# EasyEDA Pro project ProPrj_stmf4+esp32s3转接板_2025-01-29.epro, schematic Schematic1_1
Board Name: STM32F407; Create Date: 2024-12-29; Page Name: P1; Project Name: stmf4+esp32s3转接板; Schematic Name: Schematic1_1; Update Date: 2025-01-27; Company: 嘉立创EDA; Page Size: A4; Version: V1.0
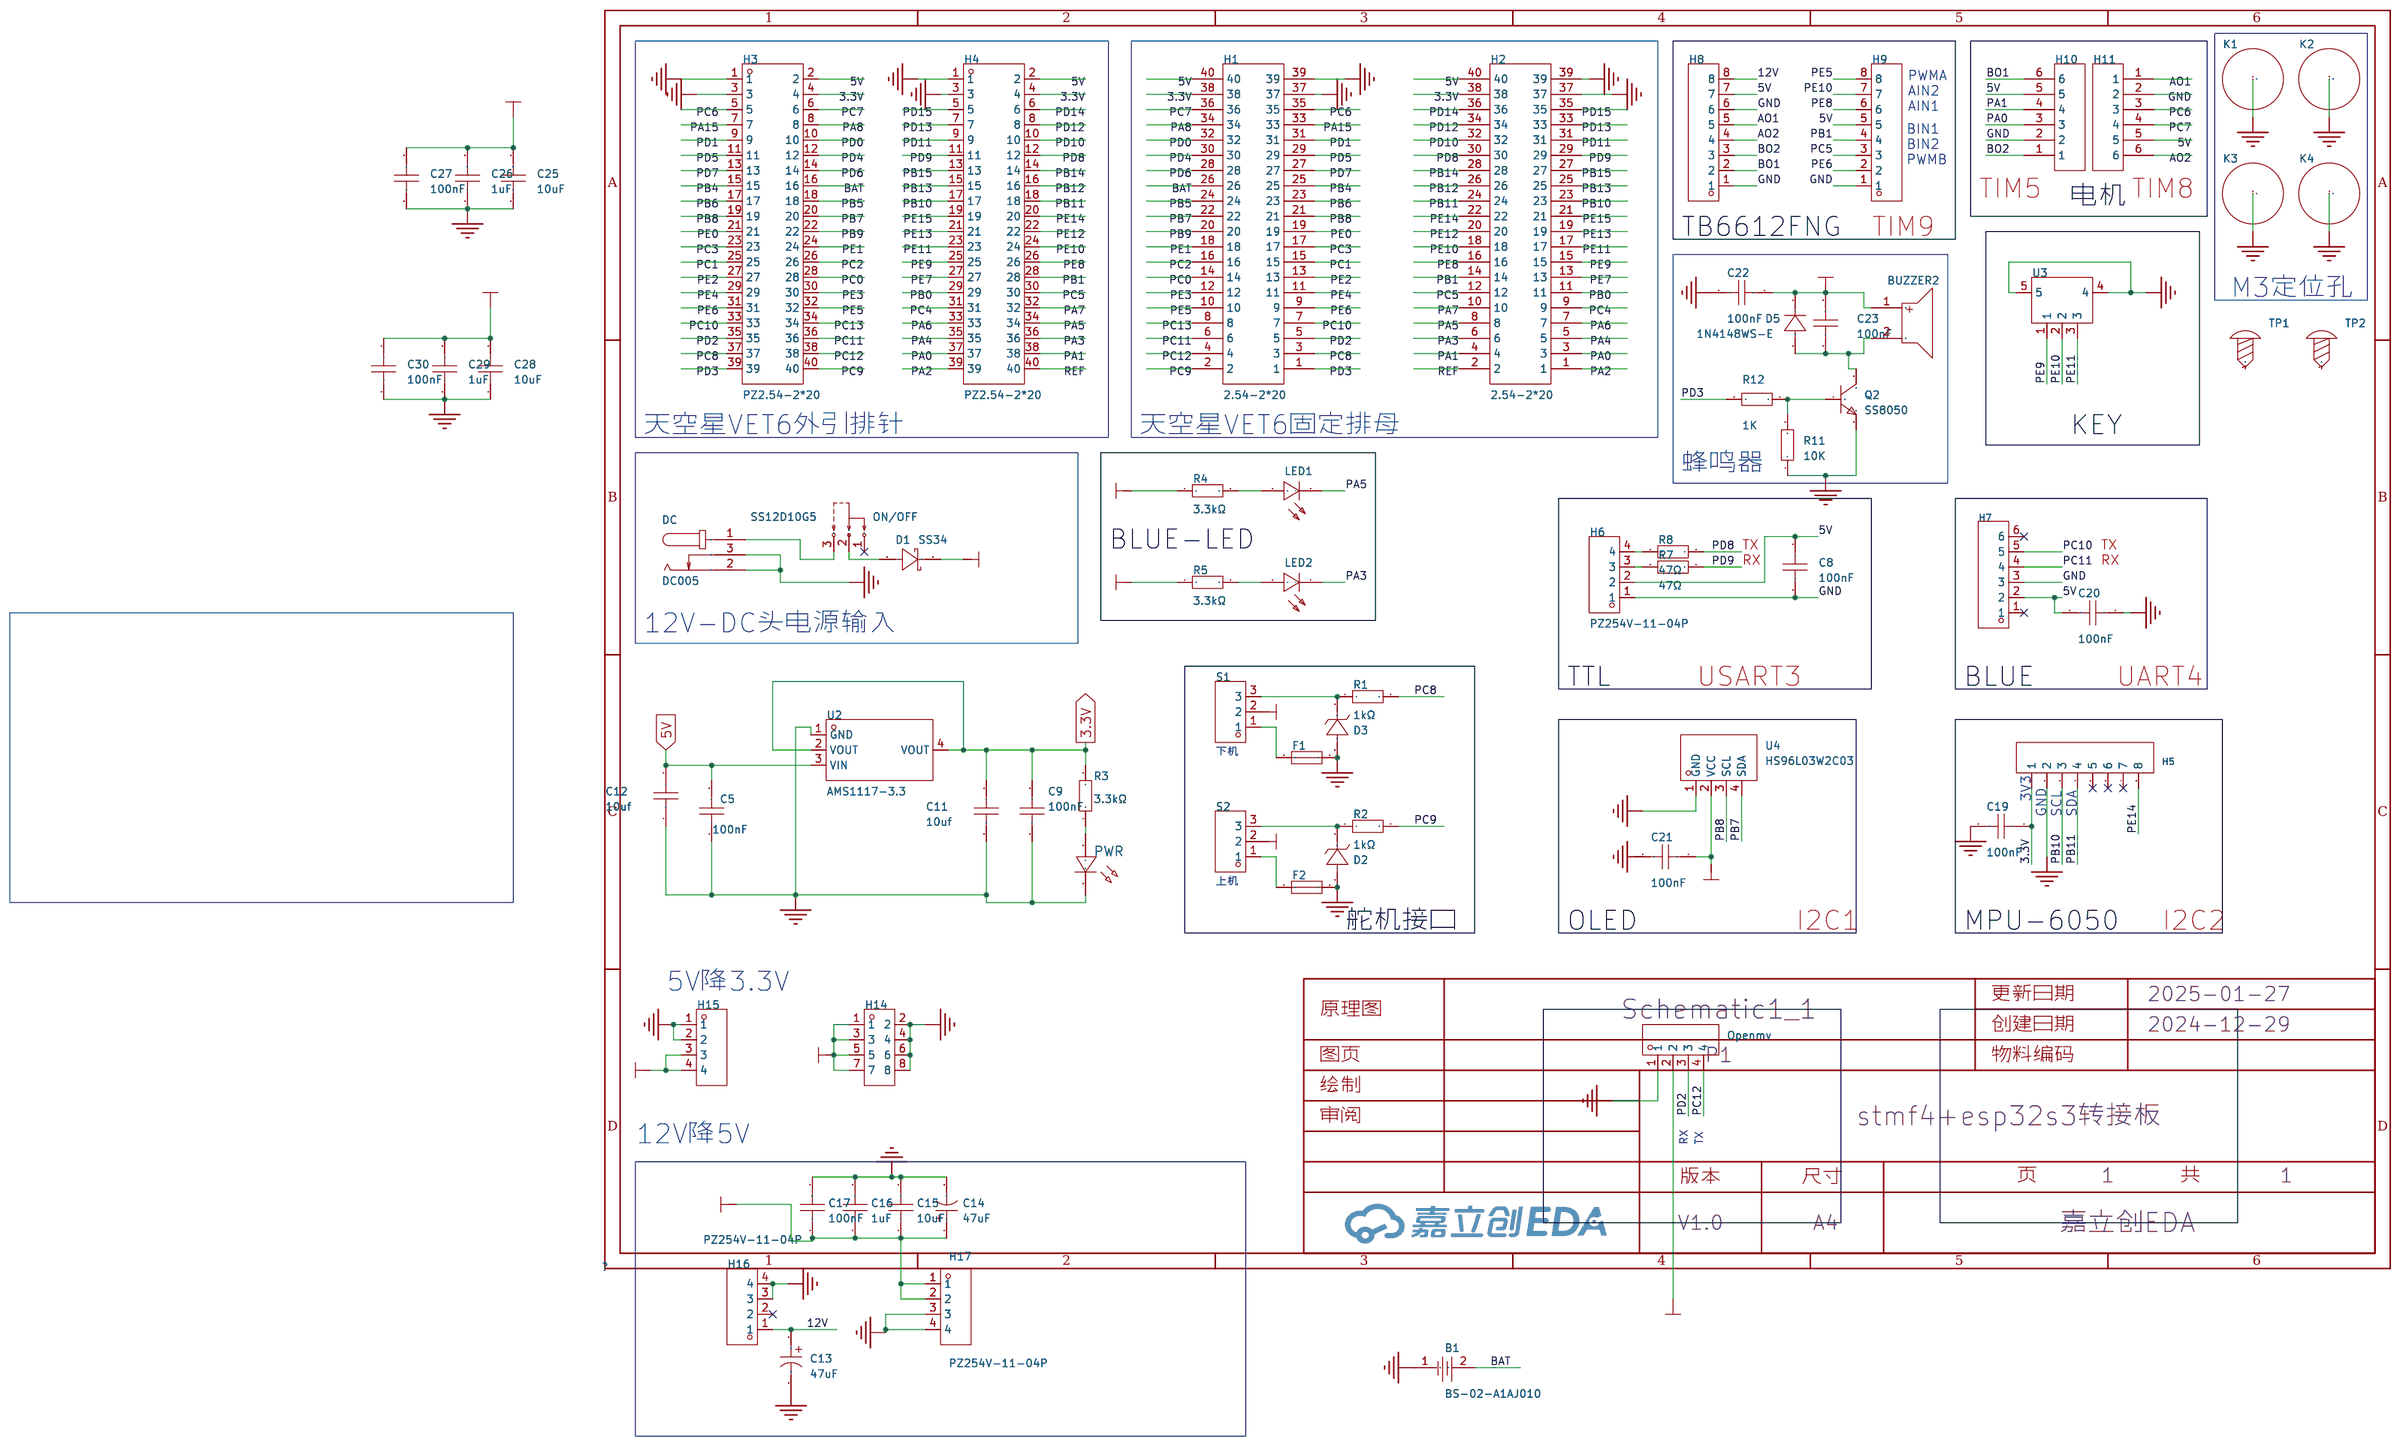
[diagram p1: schematic sheet]

## Parts
B1  BS-02-A1AJ010  [BAT-TH_BS-02-A1AJ010]
BUZZER2  2.7kHz  [BUZ-TH_BD9.0-P4.00-D0.6-FD]
C5  100nF  [C0603]
C8  100nF  [C0603]
C9  100nF  [C0805]
C11  10uf  [C0805]
C12  10uf  [C0805]
C13  47uF  [CAP-SMD_BD6.3-L6.6-W6.6-LS7.2-FD]
C14  47uF  [CAP-SMD_BD6.3-L6.6-W6.6-LS7.2-FD]
C15  10uF  [C0603]
C16  1uF  [C0603]
C17  100nF  [C0603]
C19  100nF  [C0603]
C20  100nF  [C0603]
C21  100nF  [C0603]
C22  100nF  [C0603]
C23  100nF  [C0603]
C25  10uF  [C0603]
C26  1uF  [C0603]
C27  100nF  [C0603]
C28  10uF  [C0603]
C29  1uF  [C0603]
C30  100nF  [C0603]
D1  SS34  [SMA_L4.3-W2.5-LS5.0-RD]
D2  ZMM3V3  [LL-34_L3.5-W1.5-RD]
D3  ZMM3V3  [LL-34_L3.5-W1.5-RD]
D5  1N4148WS-E  [SOD-323_L1.8-W1.3-LS2.5-RD]
DC  DC005  [DC-IN-TH_DC005]
F1  BSMD1812-200-30V  [F1812]
F2  BSMD1812-200-30V  [F1812]
H1  2.54-2*20  [HDR-TH_40P-P2.54-V-F-R2-C20-S2.54]
H2  2.54-2*20  [HDR-TH_40P-P2.54-V-F-R2-C20-S2.54]
H3  PZ2.54-2*20  [HDR-TH_40P-P2.54-V-M-R2-C20-S2.54]
H4  PZ2.54-2*20  [HDR-TH_40P-P2.54-V-M-R2-C20-S2.54]
H5  -  [HDR-TH_8P-P2.54-V-F-1]
H6  PZ254V-11-04P  [HDR-TH_4P-P2.54-V-M]
H7  -  [HDR-TH_6P-P2.54-V-F]
H8  PM254-1-08-Z-8.5  [HDR-TH_8P-P2.54-V-F]
H9  PM254-1-08-Z-8.5  [HDR-TH_8P-P2.54-V-F]
H10  B6B-XH-A(LF)(SN)  [CONN-TH_6P-P2.50_B6B-XH-A-LF-SN]
H11  B6B-XH-A(LF)(SN)  [CONN-TH_6P-P2.50_B6B-XH-A-LF-SN]
H14  PZ254V-12-8P  [HDR-TH_8P-P2.54-V-M-R2-C4-S2.54]
H15  PZ254V-11-04P  [HDR-TH_4P-P2.54-V-M]
H16  PZ254V-11-04P  [HDR-TH_4P-P2.54-V-M]
H17  PZ254V-11-04P  [HDR-TH_4P-P2.54-V-M]
K1  -  [125 X 300]
K2  -  [125 X 300]
K3  -  [125 X 300]
K4  -  [125 X 300]
LED1  NCD0603B1  [LED0603-RD]
LED2  NCD0603B1  [LED0603-RD]
ON/OFF  SS12D10G5  [SW-TH_SHOU-HAN_SS12D10G4]
Openmv  PM254-1-04-Z-8.5  [HDR-TH_4P-P2.54-V-F]
PWR  -  [LED_0603]
Q2  SS8050  [SOT-23-3_L2.9-W1.3-P1.90-LS2.4-BR]
R1  1kΩ  [R0805]
R2  1kΩ  [R0805]
R3  3.3kΩ  [R0603]
R4  3.3kΩ  [R0603]
R5  3.3kΩ  [R0603]
R7  47Ω  [R0603]
R8  47Ω  [R0603]
R11  10K  [R0603]
R12  1K  [R0603]
S1  PZ254R-11-03P  [HDR-TH_3P-P2.54-H-M-W10.4]
S2  PZ254R-11-03P  [HDR-TH_3P-P2.54-H-M-W10.4]
TP1  -  [M2螺丝]
TP2  -  [M2螺丝]
U2  AMS1117-3.3  [SOT-223-3_L6.5-W3.4-P2.30-LS7.0-BR]
U3  QS-301-AGS5P  [SW-SMD_QS-301-AGS5P]
U4  HS96L03W2C03  [OLED-TH_L27.8-W27.2-P2.54_C9900033791]

## Library data of the parts
B1 = BS-02-A1AJ010: 连接器类型:电池底座;适用电池规格:CR2032;触头材质:磷青铜;触点电镀:镍;工作温度范围:-25℃~+85℃;; LCSC Part Name: 电池底座 适用电池:CR2032; Supplier Part: C5239862; Manufacturer: MYOUNG(美阳); Supplier Footprint: 插件; JLCPCB Part Class: 扩展库; Datasheet: https://atta.szlcsc.com/upload/public/pdf/source/20221102/8F00F2B23A2A3C447A59C327BBA6C743.pdf; Supplier: LCSC; Connector Type: 电池底座; Battery Type: CR2032; Contact Material: 磷青铜; Contact Plating: 镍; Operating Temperature Range: -25℃~+85℃
BUZZER2 = QMB-09B-03: 驱动方式:无源(外部驱动);构造类型:电磁式;频率:2.7kHz;声压(SPL):85dB@3V,10cm;; LCSC Part Name: 无源蜂鸣器QMB-09B-03; Supplier Part: C96256; Manufacturer: 华能; Supplier Footprint: 插件,D=9mm; JLCPCB Part Class: 扩展库; Datasheet: https://atta.szlcsc.com/upload/public/pdf/source/20210401/C96256_958B17753B5AD7CBFBCFFC7C095B4484.pdf; Supplier: LCSC; Oscillator Circuit: 无源(外部驱动); Technology Type: 电磁式; Operating Voltage: 2V~5V; Sound Pressure Level (SPL): 85dB@3V,10cm; Diameter (φD): 9mm; Height: 5.7mm
C5 C8 = CL10B104KB8NNNC: 容值:100nF;精度:±10%;额定电压:50V;材质(温度系数):X7R;; LCSC Part Name: 100nF ±10% 50V; Supplier Part: C1591; Manufacturer: SAMSUNG(三星); Supplier Footprint: 0603; JLCPCB Part Class: 扩展库; Datasheet: https://atta.szlcsc.com/upload/public/pdf/source/20160218/1457707763339.pdf; Supplier: LCSC; Tolerance: ±10%; Voltage Rated: 50V; Temperature Coefficient: X7R
C9 C11 C12 = CAP_0805: Supplier Footprint: 0805
C13 C14 = RVT47UF35V67RV0039: 容值:47uF;精度:±20%;额定电压:35V;纹波电流:16.4mA@120Hz;等效串联电阻:-;; LCSC Part Name: 47uF ±20% 35V; Supplier Part: C2836440; Manufacturer: KNSCHA(科尼盛); Supplier Footprint: SMD,D6.3xL5.4mm; JLCPCB Part Class: 扩展库; Datasheet: https://atta.szlcsc.com/upload/public/pdf/source/20210528/C2836440_FB61BB3A7A46B9CC2A608A35871DBF0C.pdf; Supplier: LCSC; Tolerance: ±20%; Rated Voltage: 35V; Ripple Current: 16.4mA@120Hz; φD: 6.3mm; L: 5.4mm; Lifetime @ Temp: 2000hrs@105℃; Operating Temperature: -55℃~+105℃
C15 C25 C28 = CGA0603X5R106K100JT: 容值:10uF;精度:±10%;额定电压:10V;材质(温度系数):X5R;; LCSC Part Name: 10uF ±10% 10V; Supplier Part: C6119842; Manufacturer: HRE(芯声); Supplier Footprint: 0603; JLCPCB Part Class: 扩展库; Supplier: LCSC; Tolerance: ±10%; Voltage Rated: 10V; Temperature Coefficient: X5R
C16 C26 C29 = CGA0603X5R105K160JT: 容值:1uF;精度:±10%;额定电压:16V;材质(温度系数):X5R;; LCSC Part Name: 1uF ±10% 16V; Supplier Part: C6119849; Manufacturer: HRE(芯声); Supplier Footprint: 0603; JLCPCB Part Class: 扩展库; Supplier: LCSC; Tolerance: ±10%; Voltage Rated: 16V; Temperature Coefficient: X5R
C17 = CGA0603X7R104K500JT: 容值:100nF;精度:±10%;额定电压:50V;材质(温度系数):X7R;; LCSC Part Name: 100nF ±10% 50V; Supplier Part: C6119867; Manufacturer: HRE(芯声); Supplier Footprint: 0603; JLCPCB Part Class: 扩展库; Supplier: LCSC; Tolerance: ±10%; Voltage Rated: 50V; Temperature Coefficient: X7R
C19-C23 C27 C30 = CAP_0603: Supplier Footprint: 0603
D1 = SS34_C727060: 二极管配置:独立式;正向压降(Vf):550mV@3A;直流反向耐压(Vr):40V;平均整流电流(Io):3A;; LCSC Part Name: 电压:40V 电流:3A; Supplier Part: C727060; Manufacturer: TWGMC(台湾迪嘉); Supplier Footprint: SMA(DO-214AC); JLCPCB Part Class: 扩展库; Datasheet: https://atta.szlcsc.com/upload/public/pdf/source/20200828/C727059_6599B6CAC5F3238B9C33E46794659DBE.pdf; Supplier: LCSC; Diode Configuration: 独立式; Forward Voltage (Vf@If): 550mV@3A; Reverse Voltage (Vr): 40V; Average Rectified Current (Io): 3A; Reverse Leakage Current (Ir): 500uA@40V
D2 D3 = ZMM3V3_C707189: 稳压值(标称值):-;功率:500mW;精度:-;; Supplier Part: C707189; Manufacturer: Slkor(萨科微); Supplier Footprint: LL-34; JLCPCB Part Class: 扩展库; Datasheet: https://atta.szlcsc.com/upload/public/pdf/source/20200721/C707184_776B95022AAA01ECB528B9CFDAFDB27C.pdf; Supplier: LCSC; Reverse Leakage Current (Ir): 2uA@1V; Power Dissipation: 500mW
D5 = 1N4148WS-E: 二极管配置:-;正向压降(Vf):-;直流反向耐压(Vr):-;; LCSC Part Name: 开关二极管; Supplier Part: C41371421; Manufacturer: MDD(辰达半导体); Supplier Footprint: SOD-323; Datasheet: https://atta.szlcsc.com/upload/public/pdf/source/20240830/BA1E56105C5798AA4D5522D8577BF8A0.pdf; Supplier: LCSC
DC = DC005: 连接器类型:DC电源插座;安装方式:弯插;触点内径:2mm;触点外径:6.3mm;额定电流:500mA;额定电压:30V;工作温度范围:-40℃~+55℃;; LCSC Part Name: DC电源插座 内径:2mm 外径:6.3mm; Supplier Part: C431533; Manufacturer: SHOU HAN(首韩); Supplier Footprint: 插件; Datasheet: https://atta.szlcsc.com/upload/public/pdf/source/20190925/C431533_4751811035784AC1D38EBC85F7905E99.pdf; Supplier: LCSC; Connector Type: DC电源插座; Mounting Style: 弯插; Inside Contact Diameter: 2mm; Outside Contact Diameter: 6.3mm; Current Rating (Max): 500mA; Voltage Rating (Max): 30V; Operating Temperature Range: -40℃~+55℃
F1 F2 = BSMD1812-200-30V: 最大电压:30V;最大电流:40A;保持电流:2A;跳闸电流:4A;; LCSC Part Name: 30V 2A 1812自恢复; Supplier Part: C960026; Manufacturer: BHFUSE(佰宏); Supplier Footprint: 1812; JLCPCB Part Class: 扩展库; Datasheet: https://atta.szlcsc.com/upload/public/pdf/source/20230512/6ED7FF50F668B3AF958C55F12246A840.pdf; Supplier: LCSC; Operating Voltage (Max): 30V; Current Rating (Max): 40A; Hold Current: 2A; Trip Current: 4A; Power Dissipation: 1W; Resistance - Initial (Ri) (Min): 20mΩ; Resistance - Post Trip (R1) (Max): 100mΩ; Maximum Time to Trip: 2s; Operating Temperature: -40℃~+85℃
H1 H2 = 2.54-2*20: 插孔结构:2x20P;间距:2.54mm;行距:2.54mm;圆孔/方孔:方孔;安装类型:直插;排数:双排;总孔位数:40P;额定电流:2.5A;额定电压:-;插孔方向:顶部;塑高:8.5mm;工作温度范围:-40℃~+105℃;; LCSC Part Name: 间距:2.54mm 2x20P 直插; Supplier Part: C2977589; Manufacturer: ZHOURI(洲日); Supplier Footprint: 插件,P=2.54mm; JLCPCB Part Class: 扩展库; Datasheet: https://atta.szlcsc.com/upload/public/pdf/source/20220328/834E302BE3C038BBC5C70F5E02589B1E.pdf; Supplier: LCSC; Holes Structure: 2x20P; Pitch: 2.54mm; Row Spacing: 2.54mm; Circular Hole / Square Hole: 方孔; Mounting Type: 直插; Number of Rows: 双排; Number of Holes: 40P; Current Rating (Max): 2.5A; Holes Direction: 顶部; Insulation Height: 8.5mm; Operating Temperature Range: -40℃~+105℃
H3 H4 = PZ2.54-2*20: 插针结构:2x20P;间距:2.54mm;安装类型:直插;排数:双排;总PIN位数:40P;触头镀层:金;; Supplier Part: C5224014; Manufacturer: ZHOURI(洲日); Supplier Footprint: 插件,P=2.54mm; JLCPCB Part Class: 扩展库; Datasheet: https://atta.szlcsc.com/upload/public/pdf/source/20221102/7E8316C38DB6D81BB18273F4CFF8B2F6.pdf; Supplier: LCSC; Pin Structure: 2x20P; Pitch: 2.54mm; Mounting Type: 直插; Number of Rows: 双排; Number of Pins: 40P; Contact Plating: 金
H5 = HDR-F_2.54_1x8P: Supplier Part: C27438; Supplier Footprint: 插件
H6 H15-H17 = PZ254V-11-04P: 插针结构:1x4P;间距:2.54mm;行距:-;圆针/方针:方针;安装类型:直插;排数:单排;总PIN位数:4P;额定电流:3A;额定电压:250V;配合针长度:6mm;塑高:2.5mm;端接针长度:3mm;触头材质:-;工作温度范围:-40℃~+105℃;颜色:黑色;; LCSC Part Name: 间距:2.54mm 1x4P 直插 方针; Supplier Part: C2691448; Manufacturer: XFCN(兴飞); Supplier Footprint: 插件,P=2.54mm; JLCPCB Part Class: 扩展库; Datasheet: https://atta.szlcsc.com/upload/public/pdf/source/20200309/C492403_F9F19131791D08044AD4F84F8E751A34.pdf; Supplier: LCSC; Pin Structure: 1x4P; Pitch: 2.54mm; Circluar Pins/Square Pins: 方针; Mounting Type: 直插; Number of Rows: 单排; Number of Pins: 4P; Current Rating (Max): 3A; Voltage Rating (Max): 250V; Length of Mating Pin: 6mm; Insulation Height: 2.5mm; Length of End Connection Pin: 3mm; Operating Temperature Range: -40℃~+105℃; Color: 黑色
H7 = HDR-F_2.54_1x6P: Supplier Part: C40877; Supplier Footprint: 插件
H8 H9 = PM254-1-08-Z-8.5: 排数:单排;总孔位数:8P;间距:2.54mm;插孔结构:1x8P;行距:-;安装类型:直插;圆孔/方孔:方孔;额定电流:3A;额定电压:-;插孔方向:顶部;塑高:8.5mm;工作温度范围:-40℃~+105℃;; LCSC Part Name: 间距:2.54mm 1x8P 直插; Supplier Part: C2897371; Manufacturer: HCTL(华灿天禄); Supplier Footprint: 插件,P=2.54mm; JLCPCB Part Class: Extended Part; Datasheet: https://atta.szlcsc.com/upload/public/pdf/source/20230609/534BE42964C679BDE98E061007C4ABD6.pdf; Supplier: LCSC; Number of Rows: 单排; Number of Holes: 8P; Pitch: 2.54mm; Holes Structure: 1x8P; Mounting Type: 直插; Circular Hole / Square Hole: 方孔; Current Rating (Max): 3A; Holes Direction: 顶部; Insulation Height: 8.5mm; Operating Temperature Range: -40℃~+105℃
H10 H11 = B6B-XH-A(LF)(SN): 参考系列:XH;间距:2.5mm;插针结构:1x6P;排数:1;每排PIN数:6;行距:-;安装方式:-;触头材质:黄铜;; LCSC Part Name: 系列:XH 间距:2.5mm 1x6P; Supplier Part: C144397; Manufacturer: JST; Supplier Footprint: 插件,P=2.5mm; JLCPCB Part Class: Extended Part; Datasheet: https://atta.szlcsc.com/upload/public/pdf/source/20180928/C265283_F9DFEEBDB2CF642B6BDFAB4B77BD2680.pdf; Supplier: LCSC; Reference Series: XH; Pitch: 2.5mm; Pins Structure: 1x6P; Number of Rows: 1; Number of PINs Per Row: 6; Contact Material: 黄铜
H14 = PZ254V-12-8P: 插针结构:2x4P;间距:2.54mm;行距:2.54mm;圆针/方针:方针;安装类型:直插;排数:双排;总PIN位数:8P;额定电流:-;额定电压:-;配合针长度:6mm;塑高:2.5mm;端接针长度:3mm;触头材质:黄铜;触头镀层:-;工作温度范围:-40℃~+105℃;颜色:黑色;; LCSC Part Name: 间距:2.54mm 2x4P 直插 方针; Supplier Part: C492421; Manufacturer: XFCN(兴飞); Supplier Footprint: 插件,P=2.54mm; JLCPCB Part Class: 扩展库; Datasheet: https://atta.szlcsc.com/upload/public/pdf/source/20200309/C492421_DC8A206AF99CD7755BD4A5B0BC48200B.pdf; Supplier: LCSC; Pin Structure: 2x4P; Pitch: 2.54mm; Row Spacing: 2.54mm; Circluar Pins/Square Pins: 方针; Mounting Type: 直插; Number of Rows: 双排; Number of Pins: 8P; Length of Mating Pin: 6mm; Insulation Height: 2.5mm; Length of End Connection Pin: 3mm; Contact Material: 黄铜; Operating Temperature Range: -40℃~+105℃; Color: 黑色
K1-K4 = 125 X 300
LED1 LED2 = NCD0603B1: 发光颜色:蓝色;正向电压(VF):2.6V~3.6V;功率:72mW;正向电流:10mA;主波长:463nm~475nm;透镜颜色:无色透明透镜;发光强度:80mcd~220mcd;发光角度:130°;工作温度:-30℃~+85℃;; Supplier Part: C84266; Manufacturer: 国星光电; Supplier Footprint: 0603; Datasheet: https://atta.szlcsc.com/upload/public/pdf/source/20200820/C84266_6A3CDBEFA72C6CAD68EDA53474ADAE6C.pdf; Supplier: LCSC; Emitted Color: 蓝色; Forward Voltage (VF): 2.6V~3.6V; Power Dissipation: 72mW; Forward Current: 10mA; Dominant Wavelength: 463nm~475nm; Lens Color: 无色透明透镜; Luminous Intensity: 80mcd~220mcd; Viewing Angle: 130°; Operating Temperature: -30℃~+85℃
ON/OFF = SS12D10G5: 电路结构:单刀双掷;安装方式:直插;额定电流(DC):2A;额定电压(DC):125V;机械寿命:3千次;; LCSC Part Name: 两档立式插件 3脚拨动开关 柄长5.0mm; Supplier Part: C7431054; Manufacturer: SHOU HAN(首韩); Supplier Footprint: 插件; JLCPCB Part Class: 扩展库; Datasheet: https://atta.szlcsc.com/upload/public/pdf/source/20231130/7A3DB6A149BF0A1DCFFE64FFC07FE434.pdf; Supplier: LCSC; Circuit: 单刀双掷; Switch Length: 12.7mm; Switch Width: 6.7mm; Mounting Style: 直插; Current Rating (DC): 2A; Voltage Rating (DC): 125V; Mechanical Life: 3千次; Operating Temperature: -25℃~+70℃
Openmv = PM254-1-04-Z-8.5_C2897367: 插孔结构:1x4P;间距:2.54mm;行距:-;圆孔/方孔:方孔;安装类型:直插;排数:单排;总孔位数:4P;额定电流:3A;额定电压:-;插孔方向:顶部;塑高:8.5mm;触头材质:铜合金;工作温度范围:-40℃~+105℃;焊接温度(最大值):260℃@5S;; LCSC Part Name: 1x4P 间距:2.54mm 直插; Supplier Part: C2897367; Manufacturer: HCTL(华灿天禄); Supplier Footprint: 插件,P=2.54mm; JLCPCB Part Class: 扩展库; Datasheet: https://atta.szlcsc.com/upload/public/pdf/source/20230609/534BE42964C679BDE98E061007C4ABD6.pdf; Supplier: LCSC; Holes Structure: 1x4P; Pitch: 2.54mm; Circular Hole / Square Hole: 方孔; Mounting Type: 直插; Number of Rows: 单排; Number of Holes: 4P; Current Rating (Max): 3A; Holes Direction: 顶部; Insulation Height: 8.5mm; Contact Material: 铜合金; Operating Temperature Range: -40℃~+105℃; Soldering Temperature(Max): 260℃@5S
PWR = LED_0603-R: Supplier Footprint: 0603
Q2 = SS8050_C2150: 晶体管类型:NPN;集电极电流(Ic):1.5A;集射极击穿电压(Vceo):25V;功率(Pd):300mW;直流电流增益(hFE@Ic,Vce):200@100mA,1V;; LCSC Part Name: SS8050(RANGE:200-350) hfe=200~350; Supplier Part: C2150; Manufacturer: CJ(江苏长电/长晶); Supplier Footprint: SOT-23; JLCPCB Part Class: 基础库; Datasheet: https://atta.szlcsc.com/upload/public/pdf/source/20230322/AEE86F4B043774EFF80CAEA14A37D9E9.pdf; Supplier: LCSC; Transistor Type: NPN; Collector Current (Ic): 1.5A; Collector-Emitter Breakdown Voltage (Vceo): 25V; Power Dissipation (Pd): 300mW; DC Current Gain (hFE@Ic,Vce): 200@100mA,1V; Transition Frequency (fT): 100MHz; Collector Cut-Off Current (Icbo): 100nA; Collector-Emitter Saturation Voltage (VCE(sat)@Ic,Ib): 500mV@800mA,80mA
R1 R2 = 0805W8F1001T5E: 电阻类型:厚膜电阻;阻值:1kΩ;精度:±1%;功率:125mW;最大工作电压:150V;温度系数:±100ppm/℃;; LCSC Part Name: 1kΩ ±1% 125mW 厚膜电阻; Supplier Part: C17513; Manufacturer: UNI-ROYAL(厚声); Supplier Footprint: 0805; JLCPCB Part Class: 基础库; Datasheet: https://atta.szlcsc.com/upload/public/pdf/source/20200306/C422600_1E6D84923E4A46A82E41ADD87F860B5C.pdf; Supplier: LCSC; Type: 厚膜电阻; Tolerance: ±1%; Power(Watts): 125mW; Overload Voltage (Max): 150V; Temperature Coefficient: ±100ppm/℃; Operating Temperature Range: -55℃~+155℃
R3-R5 = 0603WAF3301T5E: 电阻类型:厚膜电阻;阻值:3.3kΩ;精度:±1%;功率:100mW;最大工作电压:75V;温度系数:±100ppm/℃;; LCSC Part Name: 3.3kΩ ±1% 100mW 厚膜电阻; Supplier Part: C22978; Manufacturer: UNI-ROYAL(厚声); Supplier Footprint: 0603; JLCPCB Part Class: 基础库; Datasheet: https://atta.szlcsc.com/upload/public/pdf/source/20200306/C422600_1E6D84923E4A46A82E41ADD87F860B5C.pdf; Supplier: LCSC; Type: 厚膜电阻; Tolerance: ±1%; Power(Watts): 100mW; Overload Voltage (Max): 75V; Temperature Coefficient: ±100ppm/℃; Operating Temperature Range: -55℃~+155℃
R7 R8 = 0603WAF470JT5E: 电阻类型:厚膜电阻;阻值:47Ω;精度:±1%;功率:100mW;最大工作电压:75V;温度系数:±100ppm/℃;; LCSC Part Name: 47Ω ±1% 100mW 厚膜电阻; Supplier Part: C23182; Manufacturer: UNI-ROYAL(厚声); Supplier Footprint: 0603; JLCPCB Part Class: 基础库; Datasheet: https://atta.szlcsc.com/upload/public/pdf/source/20200306/C422600_1E6D84923E4A46A82E41ADD87F860B5C.pdf; Supplier: LCSC; Type: 厚膜电阻; Tolerance: ±1%; Power(Watts): 100mW; Overload Voltage (Max): 75V; Temperature Coefficient: ±100ppm/℃; Operating Temperature Range: -55℃~+155℃
R11 R12 = Res_0603: Supplier Footprint: 0603
S1 S2 = PZ254R-11-03P: 插针结构:1x3P;间距:2.54mm;行距:-;圆针/方针:方针;安装类型:弯插;排数:单排;总PIN位数:3P;额定电流:-;额定电压:-;配合针长度:6mm;塑高:2.5mm;触头材质:黄铜;触头镀层:-;工作温度范围:-40℃~+105℃;颜色:黑色;; LCSC Part Name: 间距:2.54mm 1x3P 弯插 方针; Supplier Part: C492411; Manufacturer: XFCN(兴飞); Supplier Footprint: 弯插,P=2.54mm; JLCPCB Part Class: 扩展库; Datasheet: https://atta.szlcsc.com/upload/public/pdf/source/20200309/C492411_5256E8AAA7569F6D33B6ADBFAE4F2888.pdf; Supplier: LCSC; Pin Structure: 1x3P; Pitch: 2.54mm; Circluar Pins/Square Pins: 方针; Mounting Type: 弯插; Number of Rows: 单排; Number of Pins: 3P; Length of Mating Pin: 6mm; Insulation Height: 2.5mm; Contact Material: 黄铜; Operating Temperature Range: -40℃~+105℃; Color: 黑色
TP1 TP2 = M2螺丝: Supplier Footprint: 插件
U2 = AMS1117-3.3_C6186: 输出类型:固定;最大输入电压:-;输出电压:3.3V;最大输出电流:1A;电源纹波抑制比(PSRR):72dB@(120Hz);输出极性:正极;; LCSC Part Name: 输出3.3V 1A; Supplier Part: C6186; Manufacturer: AMS; Supplier Footprint: SOT-223; JLCPCB Part Class: 基础库; Datasheet: https://atta.szlcsc.com/upload/public/pdf/source/20180727/C6186_7A095716F0823C02F1997A905E26C086.pdf; Supplier: LCSC; Output Type: 固定; Output Voltage: 3.3V; MAX Output Current: 1A; Power Supply Rejection Ratio (PSRR): 72dB@(120Hz); Dropout Voltage: 1.3V@(800mA); Output Polarity: 正极; Number of Outputs: 1
U3 = QS-301-AGS5P: 三脚 大头拨轮多功能开关 MP3/MP4换曲按键; LCSC Part Name: 三脚 大头拨轮多功能开关 MP3/MP4换曲按键; Supplier Part: C42377853; Manufacturer: XUNPU(讯普); Supplier Footprint: SMD; Datasheet: https://atta.szlcsc.com/upload/public/pdf/source/20241106/28956C8F7821B982CBB1BD5B1BCE3D5A.pdf; Supplier: LCSC
U4 = HS96L03W2C03: 主控芯片:SSD1315;接口类型:I2C;尺寸(inch):0.96;像素分辨率:128x64;; LCSC Part Name: 0.96寸OLED显示屏窄白光IIC; Supplier Part: C5248080; Manufacturer: HS(汉昇); JLCPCB Part Class: 扩展库; Datasheet: https://atta.szlcsc.com/upload/public/pdf/source/20230627/763D01F79A90007632F098068C7C8AD9.pdf; Supplier: LCSC; Main Control Chip: SSD1315; Interface Type: I2C; Size: 0.96; Pixel Resolution: 128x64; Operating Temperature: -40℃~+70℃

## Nets
3.3V: C9.2 C11.2 C19.1 C21.1 H1.38 H2.38 H3.4 H4.4 H5.1 R3.2 R4.1 R5.1 U2.2(VOUT) U2.4(VOUT) U4.2(VCC)
5V: BUZZER2.1 C5.2 C8.1 C12.2 C14.1 C15.1 C16.1 C17.1 C20.1 C22.2 C23.2 C25.2 C26.2 C27.1 C28.2 C29.2 C30.1 D5.1(K) H1.40 H2.40 H3.2 H4.2 H6.2 H7.2 H8.7 H9.5 H10.5 H11.5 H14.1 H14.3 H14.5 H14.7 H17.1 H17.2 Openmv.2 S1.2 S2.2 U2.3(VIN)
12V: C13.1 D1.1(C) H8.8 H15.3 H15.4 H16.1
GND: B1.1 C5.1 C8.2 C9.1 C11.1 C12.1 C13.2 C14.2 C15.2 C16.2 C17.2 C19.2 C20.2 C21.2 C22.1 C25.1 C26.1 C27.2 C28.1 C29.1 C30.2 D2.2(A) D3.2(A) DC.2 DC.3 F1.2 F2.2 H1.37 H1.39 H2.37 H2.39 H3.1 H3.3 H4.1 H4.3 H5.2 H6.1 H7.3 H8.1 H8.6 H9.1 H10.2 H11.2 H14.2 H14.4 H14.6 H14.8 H15.1 H15.2 H16.3 H16.4 H17.3 H17.4 K1.1 K2.1 K3.1 K4.1 Openmv.1 PWR.1(C) Q2.2(E) R11.1 U2.1(GND) U3.4 U3.5 U4.1(GND)
AO1: H8.5 H11.1
AO2: H8.4 H11.6
BAT: B1.2 H1.26 H3.16
BO1: H8.2 H10.6
BO2: H8.3 H10.1
PA0: H2.3 H4.37 H10.3
PA1: H2.4 H4.38 H10.4
PA2: H2.1 H4.39
PA3: H2.6 H4.36 LED2.1(-)
PA4: H2.5 H4.35
PA5: H2.8 H4.34 LED1.1(-)
PA6: H2.7 H4.33
PA7: H2.10 H4.32
PA8: H1.34 H3.8
PA15: H1.33 H3.7
PB0: H2.11 H4.29
PB1: H2.14 H4.28 H9.4
PB4: H1.25 H3.15
PB5: H1.24 H3.18
PB6: H1.23 H3.17
PB7: H1.22 H3.20 U4.4(SDA)
PB8: H1.21 H3.19 U4.3(SCL)
PB9: H1.20 H3.22
PB10: H2.23 H4.17 H5.3
PB11: H2.24 H4.18 H5.4
PB12: H2.26 H4.16
PB13: H2.25 H4.15
PB14: H2.28 H4.14
PB15: H2.27 H4.13
PC0: H1.14 H3.28
PC1: H1.15 H3.25
PC2: H1.16 H3.26
PC3: H1.17 H3.23
PC4: H2.9 H4.31
PC5: H2.12 H4.30 H9.3
PC6: H1.35 H3.5 H11.3
PC7: H1.36 H3.6 H11.4
PC8: H1.3 H3.37 R1.2
PC9: H1.2 H3.40 R2.2
PC10: H1.7 H3.33 H7.5
PC11: H1.6 H3.36 H7.4
PC12: H1.4 H3.38 Openmv.4
PC13: H1.8 H3.34
PD0: H1.32 H3.10
PD1: H1.31 H3.9
PD2: H1.5 H3.35 Openmv.3
PD3: H1.1 H3.39 R12.2
PD4: H1.30 H3.12
PD5: H1.29 H3.11
PD6: H1.28 H3.14
PD7: H1.27 H3.13
PD8: H2.30 H4.12 R8.1
PD9: H2.29 H4.11 R7.1
PD10: H2.32 H4.10
PD11: H2.31 H4.9
PD12: H2.34 H4.8
PD13: H2.33 H4.7
PD14: H2.36 H4.6
PD15: H2.35 H4.5
PE0: H1.19 H3.21
PE1: H1.18 H3.24
PE2: H1.13 H3.27
PE3: H1.12 H3.30
PE4: H1.11 H3.29
PE5: H1.10 H3.32 H9.8
PE6: H1.9 H3.31 H9.2
PE7: H2.13 H4.27
PE8: H2.16 H4.26 H9.6
PE9: H2.15 H4.25 U3.1
PE10: H2.18 H4.24 H9.7 U3.2
PE11: H2.17 H4.23 U3.3
PE12: H2.20 H4.22
PE13: H2.19 H4.21
PE14: H2.22 H4.20 H5.8
PE15: H2.21 H4.19
REF: H2.2 H4.40
$1N2696: LED1.2(+) R4.2
$1N2700: LED2.2(+) R5.2
$1N2797: PWR.2(A) R3.1
$1N2806: DC.1 ON/OFF.3
$1N2808: D1.2(A) ON/OFF.2
$1N8258: H6.3 R7.2
$1N8301: H6.4 R8.2
$1N18209: D2.1(C) R2.1 S2.3
$1N18213: F2.1 S2.1
$1N18214: D3.1(C) R1.1 S1.3
$1N18218: F1.1 S1.1
$1N23987: Q2.1(B) R11.2 R12.1
$1N23989: BUZZER2.2 C23.1 D5.2(A) Q2.3(C)

Not connected (* = marked no-connect by the designer): H5 5* 6* 7*; H7 1* 6*; H16 2*; ON/OFF 1*; TP1 1; TP2 1

## Notes on the sheet
- PWMA
- AIN2
- AIN1
- BIN1
- BIN2
- PWMB
- TIM5
- 电机
- TIM8
- TB6612FNG
- TIM9
- M3定位孔
- 天空星VET6外引排针
- 天空星VET6固定排母
- KEY
- 蜂鸣器
- BLUE-LED
- TX
- TX
- RX
- RX
- 12V-DC头电源输入
- TTL
- USART3
- BLUE
- UART4
- 下机
- 3V3
- GND
- SCL
- SDA
- 上机
- 舵机接口
- OLED
- I2C1
- MPU-6050
- I2C2
- 5V降3.3V
- 12V降5V
- RX
- TX
